# Altium schematic sheet MUX_Matrix.SchDoc: Multiplekser interfejsu SWD
size A3; Organization: Altium Limited; Address1: L3, 12a Rodborough Rd; Adress2: Frenchs Forest; Address3: NSW; Address4: Australia 2086; SheetNumber: 4
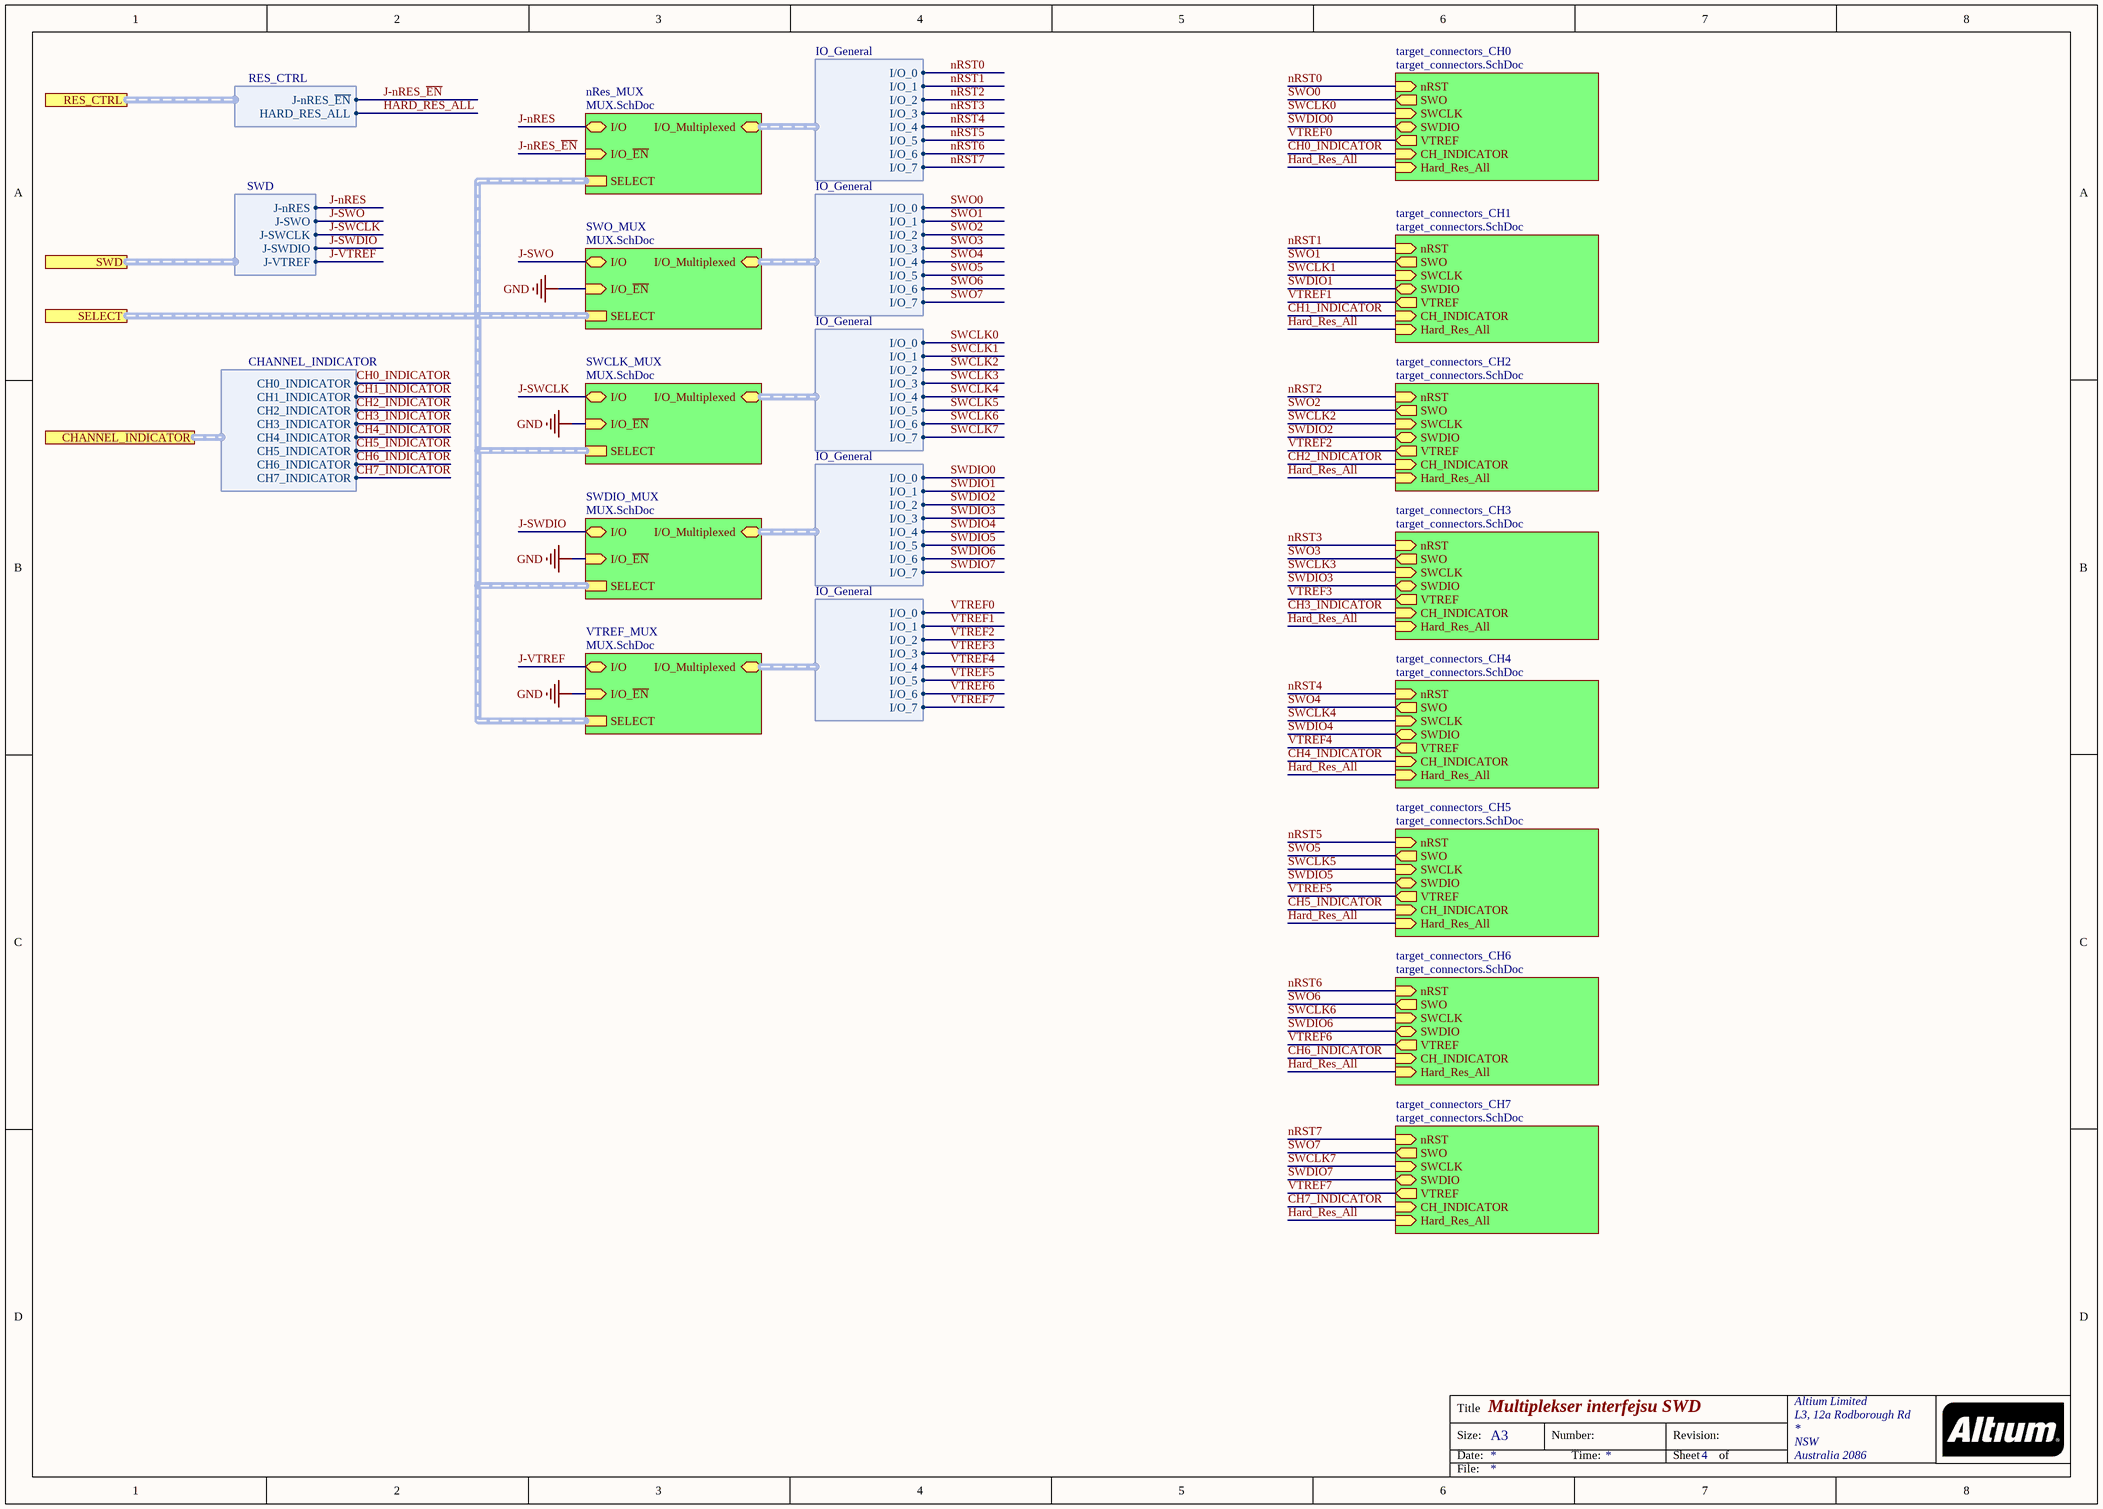
[diagram p0: MUX_Matrix.SchDoc]

## Sub-sheets
nRes_MUX = MUX.SchDoc: I/O (bidir), I/O_Multiplexed (bidir, harness IO_General), I/O_~{EN} (in), SELECT (harness SELECT)
SWCLK_MUX = MUX.SchDoc: I/O (bidir), I/O_Multiplexed (bidir, harness IO_General), SELECT (harness SELECT), I/O_~{EN} (in)
SWDIO_MUX = MUX.SchDoc: I/O (bidir), I/O_Multiplexed (bidir, harness IO_General), SELECT (harness SELECT), I/O_~{EN} (in)
SWO_MUX = MUX.SchDoc: I/O (bidir), I/O_Multiplexed (bidir, harness IO_General), SELECT (harness SELECT), I/O_~{EN} (in)
target_connectors_CH0 = target_connectors.SchDoc: nRST (in), SWO (out), SWCLK (in), SWDIO (bidir), VTREF (out), CH_INDICATOR (in), Hard_Res_All (in)
target_connectors_CH1 = target_connectors.SchDoc: nRST (in), SWO (out), SWCLK (in), SWDIO (bidir), VTREF (out), CH_INDICATOR (in), Hard_Res_All (in)
target_connectors_CH2 = target_connectors.SchDoc: nRST (in), SWO (out), SWCLK (in), SWDIO (bidir), VTREF (out), CH_INDICATOR (in), Hard_Res_All (in)
target_connectors_CH3 = target_connectors.SchDoc: nRST (in), SWO (out), SWCLK (in), SWDIO (bidir), VTREF (out), CH_INDICATOR (in), Hard_Res_All (in)
target_connectors_CH4 = target_connectors.SchDoc: nRST (in), SWO (out), SWCLK (in), SWDIO (bidir), VTREF (out), CH_INDICATOR (in), Hard_Res_All (in)
target_connectors_CH5 = target_connectors.SchDoc: nRST (in), SWO (out), SWCLK (in), SWDIO (bidir), VTREF (out), CH_INDICATOR (in), Hard_Res_All (in)
target_connectors_CH6 = target_connectors.SchDoc: nRST (in), SWO (out), SWCLK (in), SWDIO (bidir), VTREF (out), CH_INDICATOR (in), Hard_Res_All (in)
target_connectors_CH7 = target_connectors.SchDoc: nRST (in), SWO (out), SWCLK (in), SWDIO (bidir), VTREF (out), CH_INDICATOR (in), Hard_Res_All (in)
VTREF_MUX = MUX.SchDoc: I/O (bidir), I/O_Multiplexed (bidir, harness IO_General), SELECT (harness SELECT), I/O_~{EN} (in)

## Ports
CHANNEL_INDICATOR (harness CHANNEL_INDICATOR), RES_CTRL (harness RES_CTRL), SELECT (harness SELECT), SWD (harness SWD)

## Harnesses
SWD: J-nRES, J-SWO, J-SWCLK, J-SWDIO, J-VTREF
IO_General: I/O_0, I/O_1, I/O_2, I/O_3, I/O_5, I/O_6, I/O_7, I/O_4
RES_CTRL: HARD_RES_ALL, J-nRES_~{EN}
CHANNEL_INDICATOR: CH1_INDICATOR, CH2_INDICATOR, CH3_INDICATOR, CH4_INDICATOR, CH5_INDICATOR, CH6_INDICATOR, CH7_INDICATOR, CH0_INDICATOR

## Nets
GND: sheet SWO_MUX/I/O_~{EN}, sheet SWCLK_MUX/I/O_~{EN}, sheet SWDIO_MUX/I/O_~{EN}, sheet VTREF_MUX/I/O_~{EN}
CH0_INDICATOR: sheet target_connectors_CH0/CH_INDICATOR, port CHANNEL_INDICATOR.CH0_INDICATOR
CH1_INDICATOR: sheet target_connectors_CH1/CH_INDICATOR, port CHANNEL_INDICATOR.CH1_INDICATOR
CH2_INDICATOR: sheet target_connectors_CH2/CH_INDICATOR, port CHANNEL_INDICATOR.CH2_INDICATOR
CH3_INDICATOR: sheet target_connectors_CH3/CH_INDICATOR, port CHANNEL_INDICATOR.CH3_INDICATOR
CH4_INDICATOR: sheet target_connectors_CH4/CH_INDICATOR, port CHANNEL_INDICATOR.CH4_INDICATOR
CH5_INDICATOR: sheet target_connectors_CH5/CH_INDICATOR, port CHANNEL_INDICATOR.CH5_INDICATOR
CH6_INDICATOR: sheet target_connectors_CH6/CH_INDICATOR, port CHANNEL_INDICATOR.CH6_INDICATOR
CH7_INDICATOR: sheet target_connectors_CH7/CH_INDICATOR, port CHANNEL_INDICATOR.CH7_INDICATOR
HARD_RES_ALL: sheet target_connectors_CH0/Hard_Res_All, sheet target_connectors_CH1/Hard_Res_All, sheet target_connectors_CH2/Hard_Res_All, sheet target_connectors_CH3/Hard_Res_All, sheet target_connectors_CH4/Hard_Res_All, sheet target_connectors_CH5/Hard_Res_All, sheet target_connectors_CH6/Hard_Res_All, sheet target_connectors_CH7/Hard_Res_All, port RES_CTRL.HARD_RES_ALL
J-nRES: sheet nRes_MUX/I/O, port SWD.J-nRES
J-nRES_~{EN}: sheet nRes_MUX/I/O_~{EN}, port RES_CTRL.J-nRES_~{EN}
J-SWCLK: sheet SWCLK_MUX/I/O, port SWD.J-SWCLK
J-SWDIO: sheet SWDIO_MUX/I/O, port SWD.J-SWDIO
J-SWO: sheet SWO_MUX/I/O, port SWD.J-SWO
J-VTREF: sheet VTREF_MUX/I/O, port SWD.J-VTREF
nRST0: sheet target_connectors_CH0/nRST, sheet nRes_MUX/I/O_Multiplexed.I/O_0
nRST1: sheet target_connectors_CH1/nRST, sheet nRes_MUX/I/O_Multiplexed.I/O_1
nRST2: sheet target_connectors_CH2/nRST, sheet nRes_MUX/I/O_Multiplexed.I/O_2
nRST3: sheet target_connectors_CH3/nRST, sheet nRes_MUX/I/O_Multiplexed.I/O_3
nRST4: sheet target_connectors_CH4/nRST, sheet nRes_MUX/I/O_Multiplexed.I/O_4
nRST5: sheet target_connectors_CH5/nRST, sheet nRes_MUX/I/O_Multiplexed.I/O_5
nRST6: sheet target_connectors_CH6/nRST, sheet nRes_MUX/I/O_Multiplexed.I/O_6
nRST7: sheet target_connectors_CH7/nRST, sheet nRes_MUX/I/O_Multiplexed.I/O_7
SWCLK0: sheet target_connectors_CH0/SWCLK, sheet SWCLK_MUX/I/O_Multiplexed.I/O_0
SWCLK1: sheet target_connectors_CH1/SWCLK, sheet SWCLK_MUX/I/O_Multiplexed.I/O_1
SWCLK2: sheet target_connectors_CH2/SWCLK, sheet SWCLK_MUX/I/O_Multiplexed.I/O_2
SWCLK3: sheet target_connectors_CH3/SWCLK, sheet SWCLK_MUX/I/O_Multiplexed.I/O_3
SWCLK4: sheet target_connectors_CH4/SWCLK, sheet SWCLK_MUX/I/O_Multiplexed.I/O_4
SWCLK5: sheet target_connectors_CH5/SWCLK, sheet SWCLK_MUX/I/O_Multiplexed.I/O_5
SWCLK6: sheet target_connectors_CH6/SWCLK, sheet SWCLK_MUX/I/O_Multiplexed.I/O_6
SWCLK7: sheet target_connectors_CH7/SWCLK, sheet SWCLK_MUX/I/O_Multiplexed.I/O_7
SWDIO0: sheet target_connectors_CH0/SWDIO, sheet SWDIO_MUX/I/O_Multiplexed.I/O_0
SWDIO1: sheet target_connectors_CH1/SWDIO, sheet SWDIO_MUX/I/O_Multiplexed.I/O_1
SWDIO2: sheet target_connectors_CH2/SWDIO, sheet SWDIO_MUX/I/O_Multiplexed.I/O_2
SWDIO3: sheet target_connectors_CH3/SWDIO, sheet SWDIO_MUX/I/O_Multiplexed.I/O_3
SWDIO4: sheet target_connectors_CH4/SWDIO, sheet SWDIO_MUX/I/O_Multiplexed.I/O_4
SWDIO5: sheet target_connectors_CH5/SWDIO, sheet SWDIO_MUX/I/O_Multiplexed.I/O_5
SWDIO6: sheet target_connectors_CH6/SWDIO, sheet SWDIO_MUX/I/O_Multiplexed.I/O_6
SWDIO7: sheet target_connectors_CH7/SWDIO, sheet SWDIO_MUX/I/O_Multiplexed.I/O_7
SWO0: sheet target_connectors_CH0/SWO, sheet SWO_MUX/I/O_Multiplexed.I/O_0
SWO1: sheet target_connectors_CH1/SWO, sheet SWO_MUX/I/O_Multiplexed.I/O_1
SWO2: sheet target_connectors_CH2/SWO, sheet SWO_MUX/I/O_Multiplexed.I/O_2
SWO3: sheet target_connectors_CH3/SWO, sheet SWO_MUX/I/O_Multiplexed.I/O_3
SWO4: sheet target_connectors_CH4/SWO, sheet SWO_MUX/I/O_Multiplexed.I/O_4
SWO5: sheet target_connectors_CH5/SWO, sheet SWO_MUX/I/O_Multiplexed.I/O_5
SWO6: sheet target_connectors_CH6/SWO, sheet SWO_MUX/I/O_Multiplexed.I/O_6
SWO7: sheet target_connectors_CH7/SWO, sheet SWO_MUX/I/O_Multiplexed.I/O_7
VTREF0: sheet target_connectors_CH0/VTREF, sheet VTREF_MUX/I/O_Multiplexed.I/O_0
VTREF1: sheet target_connectors_CH1/VTREF, sheet VTREF_MUX/I/O_Multiplexed.I/O_1
VTREF2: sheet target_connectors_CH2/VTREF, sheet VTREF_MUX/I/O_Multiplexed.I/O_2
VTREF3: sheet target_connectors_CH3/VTREF, sheet VTREF_MUX/I/O_Multiplexed.I/O_3
VTREF4: sheet target_connectors_CH4/VTREF, sheet VTREF_MUX/I/O_Multiplexed.I/O_4
VTREF5: sheet target_connectors_CH5/VTREF, sheet VTREF_MUX/I/O_Multiplexed.I/O_5
VTREF6: sheet target_connectors_CH6/VTREF, sheet VTREF_MUX/I/O_Multiplexed.I/O_6
VTREF7: sheet target_connectors_CH7/VTREF, sheet VTREF_MUX/I/O_Multiplexed.I/O_7

## Buses and harness runs
harness port SELECT = sheet nRes_MUX/SELECT = sheet SWCLK_MUX/SELECT = sheet SWDIO_MUX/SELECT = sheet SWO_MUX/SELECT = sheet VTREF_MUX/SELECT

## Notes on the sheet
- Title
- Size:
- Date:
- A3
- Number:
- Time:
- Revision:
- Sheet
- of
- File: